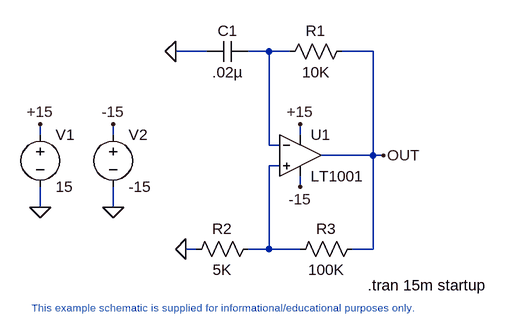
[diagram p0: schematic relax.asc]
relax.asc, the LTspice schematic file:
Version 4
SHEET 1 1464 1616
WIRE 976 1088 928 1088
WIRE 1072 1088 1040 1088
WIRE 1104 1088 1072 1088
WIRE 1232 1088 1184 1088
WIRE 720 1216 720 1200
WIRE 832 1216 832 1200
WIRE 1120 1216 1120 1200
WIRE 1072 1232 1072 1088
WIRE 1088 1232 1072 1232
WIRE 1232 1248 1232 1088
WIRE 1232 1248 1152 1248
WIRE 1248 1248 1232 1248
WIRE 1088 1264 1072 1264
WIRE 1120 1296 1120 1280
WIRE 720 1328 720 1296
WIRE 832 1328 832 1296
WIRE 960 1392 944 1392
WIRE 1072 1392 1072 1264
WIRE 1072 1392 1040 1392
WIRE 1120 1392 1072 1392
WIRE 1232 1392 1232 1248
WIRE 1232 1392 1200 1392
FLAG 928 1088 0
FLAG 720 1328 0
FLAG 832 1328 0
FLAG 1248 1248 OUT
FLAG 944 1392 0
FLAG 1120 1200 +15
FLAG 720 1200 +15
FLAG 832 1200 -15
FLAG 1120 1296 -15
SYMBOL res 1200 1072 R90
WINDOW 0 0 56 VBottom 2
WINDOW 3 32 56 VTop 2
SYMATTR InstName R1
SYMATTR Value 10K
SYMBOL voltage 720 1200 R0
SYMATTR InstName V1
SYMATTR Value 15
SYMBOL voltage 832 1200 R0
SYMATTR InstName V2
SYMATTR Value -15
SYMBOL res 1056 1376 R90
WINDOW 0 0 56 VBottom 2
WINDOW 3 32 56 VTop 2
SYMATTR InstName R2
SYMATTR Value 5K
SYMBOL cap 1040 1072 R90
WINDOW 0 0 32 VBottom 2
WINDOW 3 32 32 VTop 2
SYMATTR InstName C1
SYMATTR Value .02µ
SYMBOL res 1216 1376 R90
WINDOW 0 0 56 VBottom 2
WINDOW 3 32 56 VTop 2
SYMATTR InstName R3
SYMATTR Value 100K
SYMBOL opamps\\LT1001 1120 1184 R0
SYMATTR InstName U1
TEXT 1224 1448 Left 2 !.tran 15m startup
TEXT 992 1472 Top 1 ;This example schematic is supplied for informational/educational purposes only.

The netlist it stands for:
* relax.asc
R1 OUT N001 10K
V1 +15 0 15
V2 -15 0 -15
R2 N002 0 5K
C1 N001 0 .02µ
R3 OUT N002 100K
XU1 N002 N001 +15 -15 OUT LT1001  ; pins In+ In- V+ V- OUT
.tran 15m startup
* This example schematic is supplied for informational/educational purposes only.
.lib LTC.lib
.backanno
.end